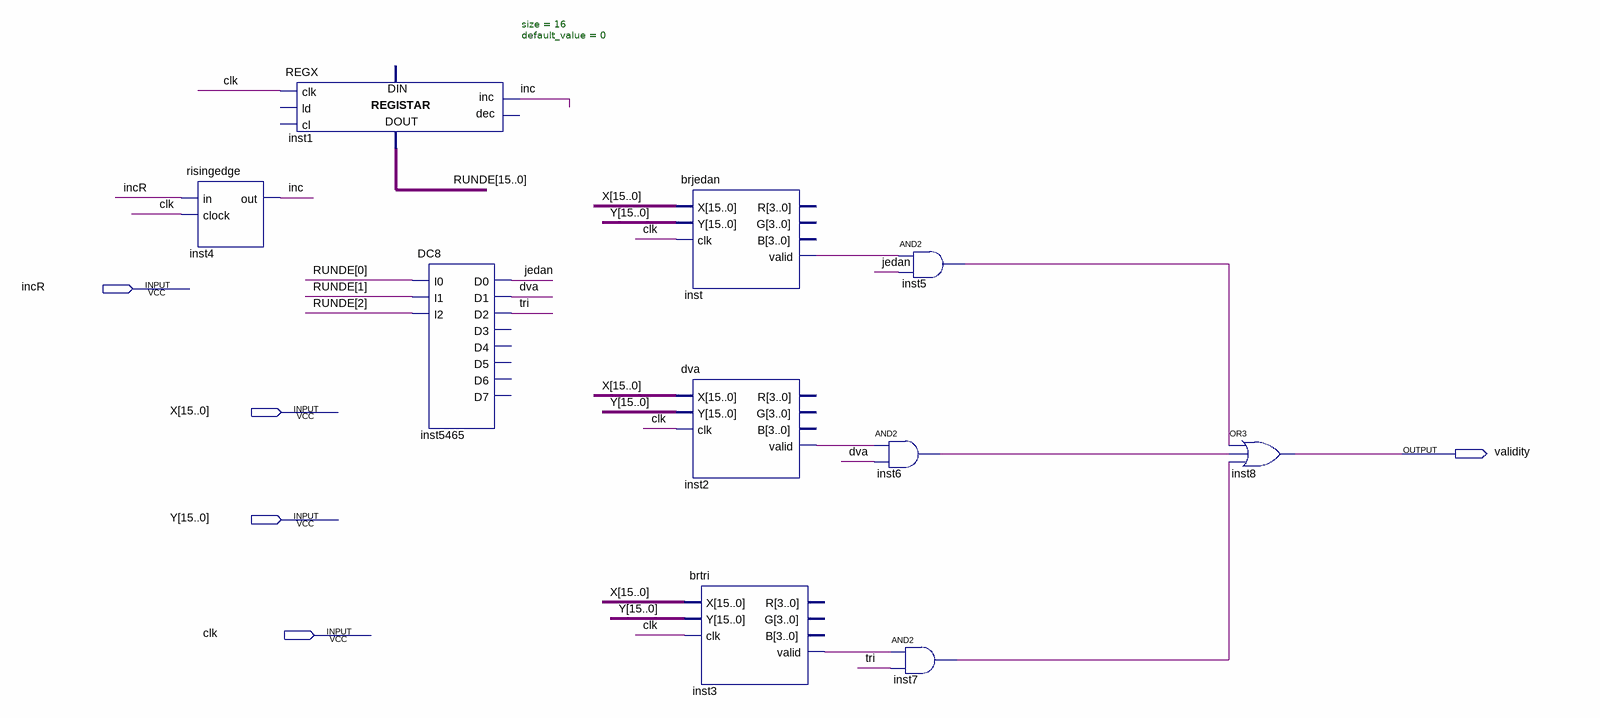
[diagram p0: schematic sheet]
// Quartus schematic rundacnt.bdf as structural Verilog: 10 symbols, 5 pins
module rundacnt (
  input  incR,
  input  [15:0] X,
  input  [15:0] Y,
  input  clk,
  output validity
);

  wire dva, inc, inst2_valid, inst3_valid, inst5_out, inst6_out, inst7_out, inst_valid, jedan, \tri ;
  wire [15:0] RUNDE;

  risingedge inst4 (.in(incR), .clock(clk), .out(inc));
  REGX #(.size(16), .default_value(0)) inst1 (.clk(clk), .inc(inc), .data_out(RUNDE));  // open: ld, cl, dec, data_in
  DC8 inst5465 (
    .I0(RUNDE[0]), .I1(RUNDE[1]), .I2(RUNDE[2]), .D0(jedan), .D1(dva), .D2(\tri ));  // open: D3, D4, D5, D6, D7
  brjedan inst (.X(X), .Y(Y), .clk(clk), .valid(inst_valid));  // open: R, G, B
  dva inst2 (.X(X), .Y(Y), .clk(clk), .valid(inst2_valid));  // open: R, G, B
  brtri inst3 (.X(X), .Y(Y), .clk(clk), .valid(inst3_valid));  // open: R, G, B
  and inst5 (inst5_out, inst_valid, jedan);
  and inst6 (inst6_out, inst2_valid, dva);
  and inst7 (inst7_out, inst3_valid, \tri );
  or inst8 (validity, inst5_out, inst6_out, inst7_out);
endmodule
